# EAGLE design TakpadV6.1 (EAGLE 8.4.0)

## Sheet 1 of 2
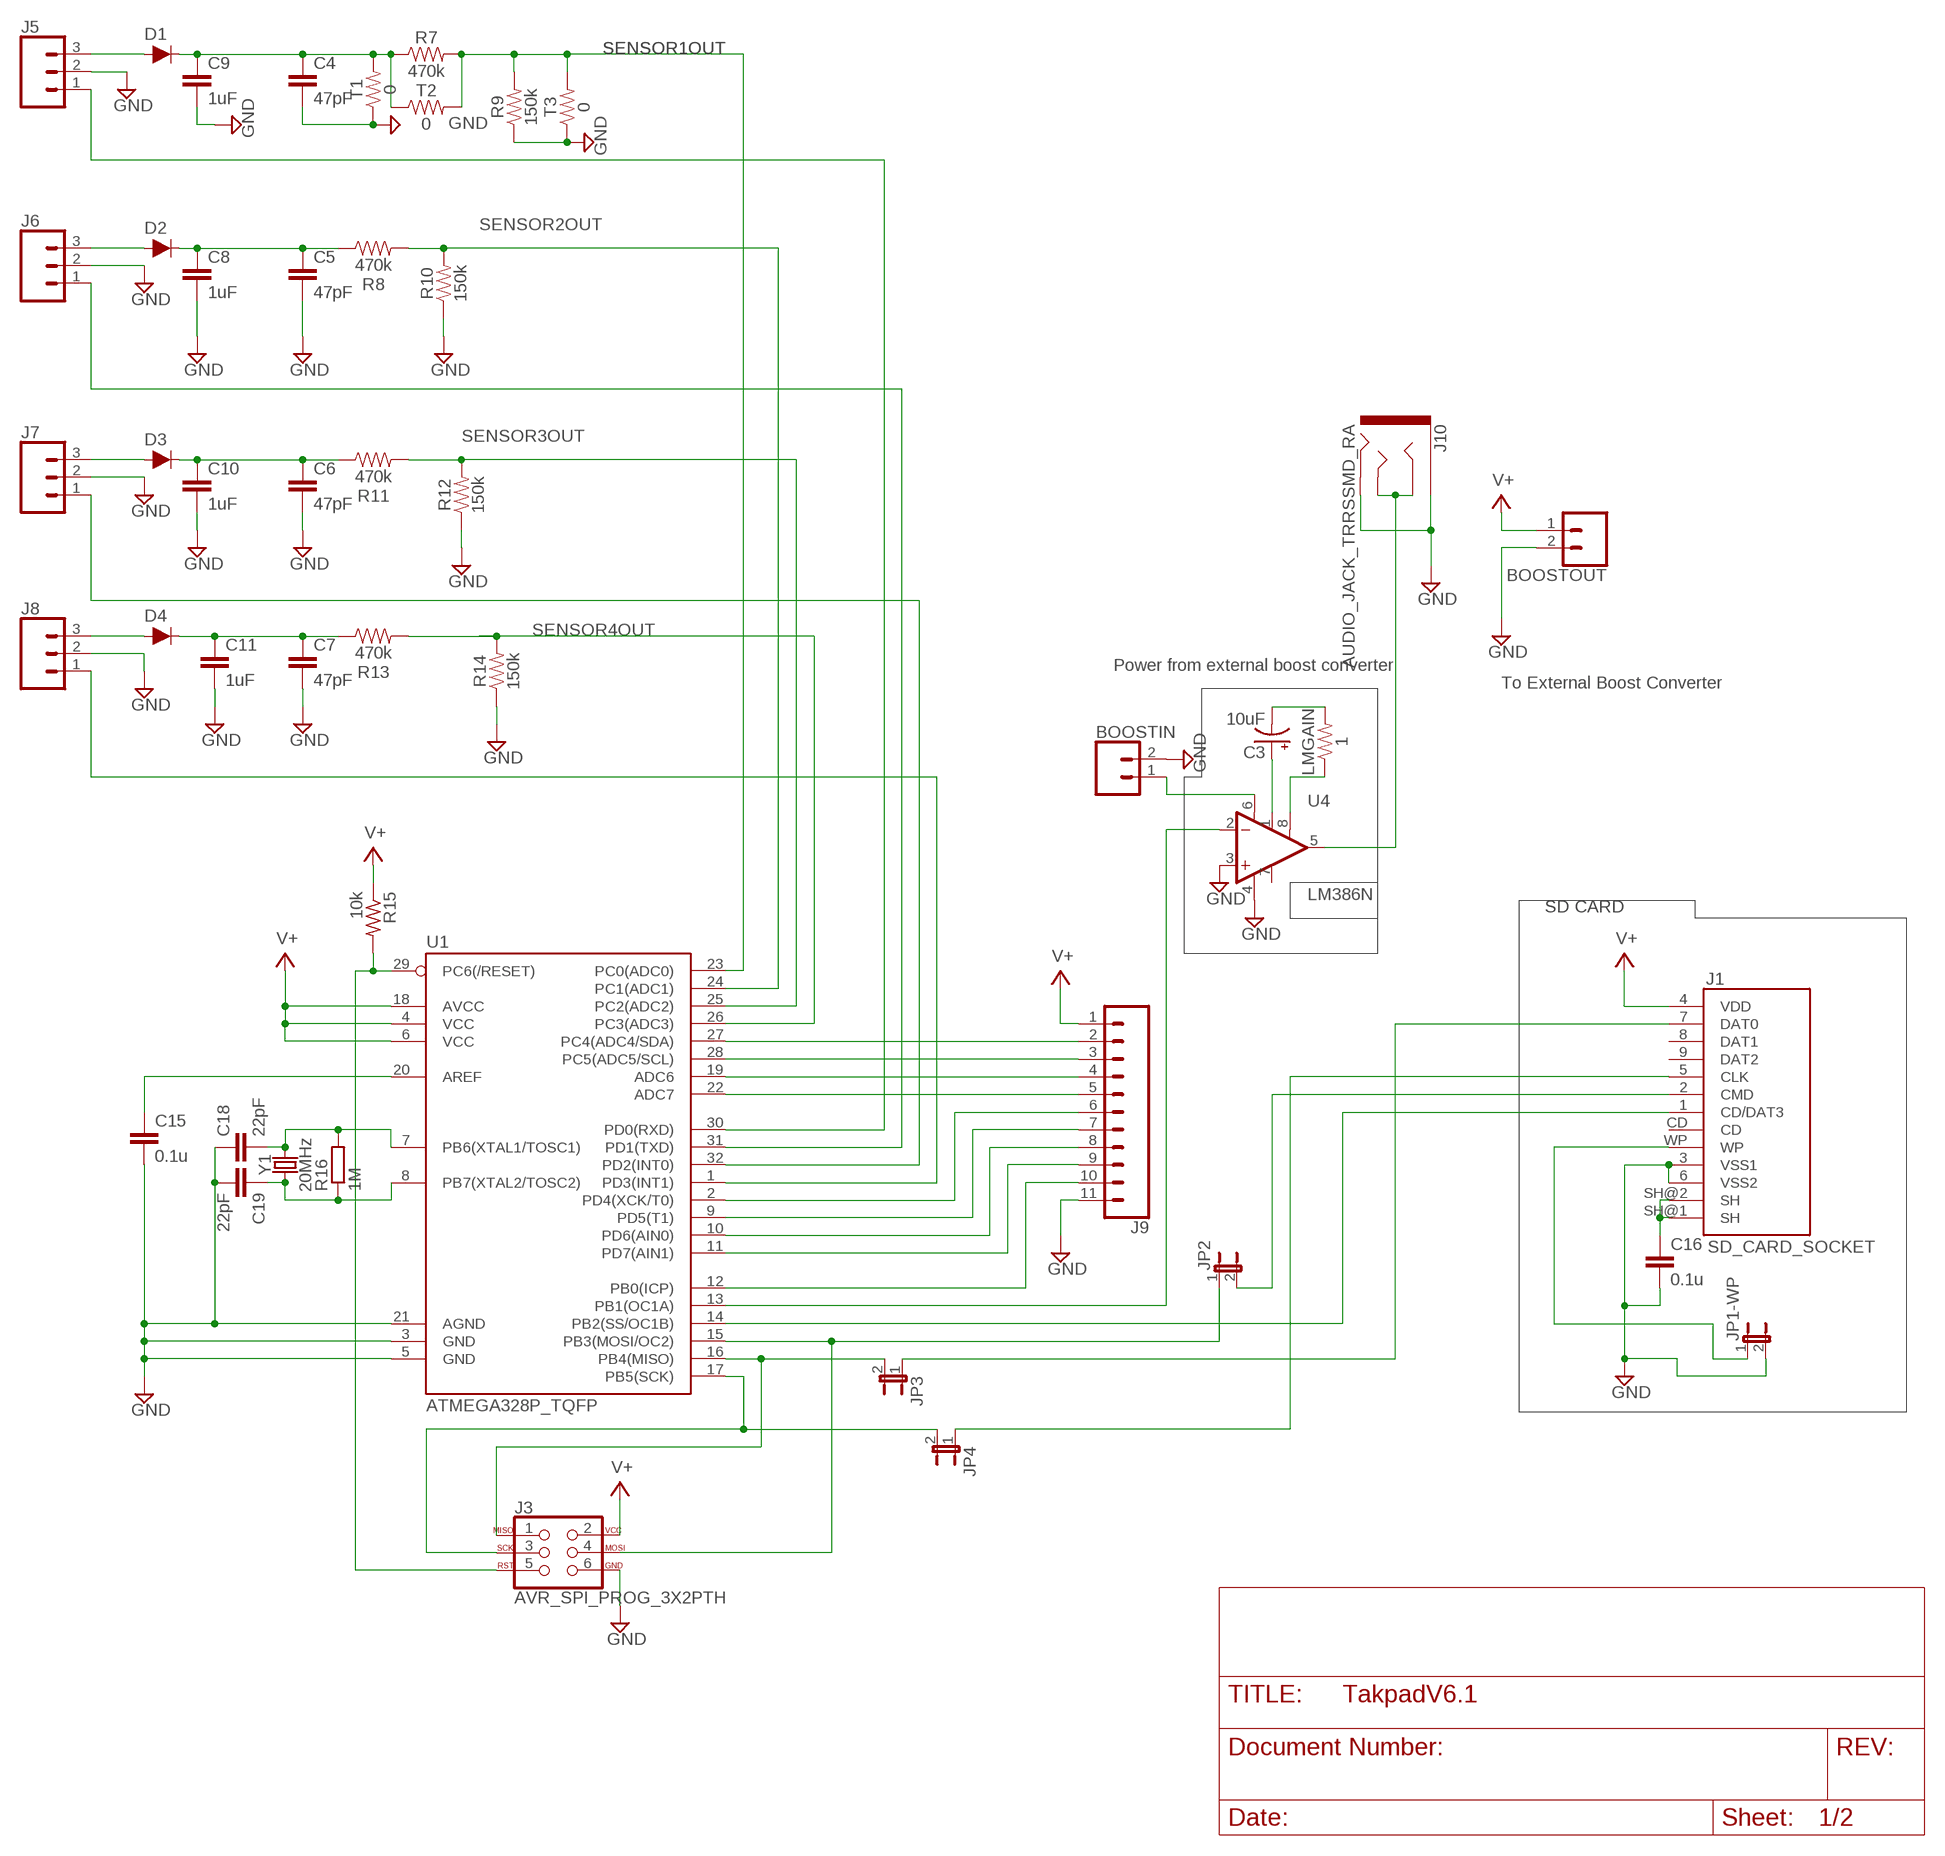
[diagram p0: schematic, sheet 1]

### Parts
BOOSTIN  CONN_02  [1X02]
BOOSTOUT  CONN_02  [1X02]
C3  10uF  10UF-POLAR-RADIAL-2.5MM-KIT-25V-20%  [CPOL-RADIAL-2.5MM-5MM-KIT]
C4  47pF  47PF-0603-50V-5%  [0603]
C5  47pF  47PF-0603-50V-5%  [0603]
C6  47pF  47PF-0603-50V-5%  [0603]
C7  47pF  47PF-0603-50V-5%  [0603]
C8  1uF  47PF-0603-50V-5%  [0603]
C9  1uF  47PF-0603-50V-5%  [0603]
C10  1uF  47PF-0603-50V-5%  [0603]
C11  1uF  47PF-0603-50V-5%  [0603]
C15  0.1u  C-EUC0402  [C0402]
C16  0.1u  C-EUC0402  [C0402]
C18  22pF  C-EUC0402  [C0402]
C19  22pF  C-EUC0402  [C0402]
D1  200mA/100V/1V  DIODE-1N4148  [DIODE-1N4148]
D2  200mA/100V/1V  DIODE-1N4148  [DIODE-1N4148]
D3  200mA/100V/1V  DIODE-1N4148  [DIODE-1N4148]
D4  200mA/100V/1V  DIODE-1N4148  [DIODE-1N4148]
J1  SD_CARD_SOCKET  [SD]
J3  AVR_SPI_PROG_3X2PTH  [2X3]
J5  CONN_03  [1X03]
J6  CONN_03  [1X03]
J7  CONN_03  [1X03]
J8  CONN_03  [1X03]
J9  CONN_11  [1X11]
J10  AUDIO_JACK_TRRSSMD_RA  [AUDIO_JACK_3.5MM_TRRS_SMD_RA]
JP1-WP  JUMPER-2PTH  [1X02]
JP2  JUMPER-2PTH  [1X02]
JP3  JUMPER-2PTH  [1X02]
JP4  JUMPER-2PTH  [1X02]
LMGAIN  1  1OHM-0603-1/10W-1%  [0603]
R7  470k  1KOHM-HORIZ-1/4W-1%  [AXIAL-0.3]
R8  470k  1KOHM-HORIZ-1/4W-1%  [AXIAL-0.3]
R9  150k  1KOHM-HORIZ-1/4W-1%  [AXIAL-0.3]
R10  150k  1KOHM-HORIZ-1/4W-1%  [AXIAL-0.3]
R11  470k  1KOHM-HORIZ-1/4W-1%  [AXIAL-0.3]
R12  150k  1KOHM-HORIZ-1/4W-1%  [AXIAL-0.3]
R13  470k  1KOHM-HORIZ-1/4W-1%  [AXIAL-0.3]
R14  150k  1KOHM-HORIZ-1/4W-1%  [AXIAL-0.3]
R15  10k  R-US_M1206  [M1206]
R16  1M  R-EU_R0402  [R0402]
T1  0  1KOHM-HORIZ-1/4W-1%  [AXIAL-0.3]
T2  0  1KOHM-HORIZ-1/4W-1%  [AXIAL-0.3]
T3  0  1KOHM-HORIZ-1/4W-1%  [AXIAL-0.3]
U1  ATMEGA328P_TQFP  [TQFP32-08]
U4  LM386N  LM386  [DIP08]
Y1  20MHz  CRYSTAL-16MHZPTH-HC49US  [HC49US]

### Nets
ADC4: J9.2 U1.27(PC4(ADC4/SDA))
ADC5: J9.3 U1.28(PC5(ADC5/SCL))
ADC6: J9.4 U1.19(ADC6)
ADC7: J9.5 U1.22(ADC7)
AREF: C15.1 U1.20(AREF)
AUDIOINPUT: U1.13(PB1(OC1A)) U4.2(-IN)
AUDIOOUT: J10.RING1 J10.TIP U4.5(OUT)
CD/DAT3: J1.1(CD/DAT3) U1.14(PB2(SS/OC1B))
CLK: J1.5(CLK) JP4.1
CMD: J1.2(CMD) JP2.2
DAT0: J1.7(DAT0) JP3.1
GND: BOOSTIN.2 BOOSTOUT.2 C4.2 C5.2 C6.2 C7.2 C8.2 C9.2 C10.2 C11.2 C15.2 C16.2 C18.1 C19.2 J1.3(VSS1) J1.6(VSS2) J3.6 J5.2 J6.2 J7.2 J8.2 J9.11 J10.EARTH J10.RING2 JP1-WP.2 R9.P$1 R10.P$1 R12.P$1 R14.P$1 T1.P$1 T3.P$1 U1.3(GND) U1.5(GND) U1.21(AGND) U4.3(+IN) U4.4(V-) ; also sheet 2
MISO: J3.1 JP3.2 U1.16(PB4(MISO))
MOSI: J3.4 JP2.1 U1.15(PB3(MOSI/OC2))
N$9: C3.1(+) U4.1(GAIN)
N$10: C3.2(-) LMGAIN.2
N$11: LMGAIN.1 U4.8(GAIN)
N$17: C16.1 J1.SH@1(SH) J1.SH@2(SH)
PB6: C18.2 R16.2 U1.7(PB6(XTAL1/TOSC1)) Y1.2
PB7: C19.1 R16.1 U1.8(PB7(XTAL2/TOSC2)) Y1.1
PD4: J9.6 U1.2(PD4(XCK/T0))
PD5: J9.7 U1.9(PD5(T1))
PD6: J9.8 U1.10(PD6(AIN0))
PD7: J9.9 U1.11(PD7(AIN1))
PD8: J9.10 U1.12(PB0(ICP))
RST: J3.5 R15.2 U1.29(PC6(/RESET))
SCK: J3.3 JP4.2 U1.17(PB5(SCK))
SENS1LED: J5.1 U1.30(PD0(RXD))
SENS2LED: J6.1 U1.31(PD1(TXD))
SENS3LED: J7.1 U1.32(PD2(INT0))
SENS4LED: J8.1 U1.1(PD3(INT1))
SENSOR1: D1.A J5.3
SENSOR1IN: C4.1 C9.1 D1.C R7.P$1 T1.P$2 T2.P$1
SENSOR1OUT: R7.P$2 R9.P$2 T2.P$2 T3.P$2 U1.23(PC0(ADC0))
SENSOR2: D2.A J6.3
SENSOR2IN: C5.1 C8.1 D2.C R8.P$1
SENSOR2OUT: R8.P$2 R10.P$2 U1.24(PC1(ADC1))
SENSOR3: D3.A J7.3
SENSOR3IN: C6.1 C10.1 D3.C R11.P$1
SENSOR3OUT: R11.P$2 R12.P$2 U1.25(PC2(ADC2))
SENSOR4: D4.A J8.3
SENSOR4IN: C7.1 C11.1 D4.C R13.P$1
SENSOR4OUT: R13.P$2 R14.P$2 U1.26(PC3(ADC3))
UPCONVERTERINPUT: BOOSTIN.1 U4.6(V+)
V+: BOOSTOUT.1 J1.4(VDD) J3.2 J9.1 R15.1 U1.4(VCC) U1.6(VCC) U1.18(AVCC) ; also sheet 2
WP: J1.WP JP1-WP.1
Unconnected: J1.8(DAT1) J1.9(DAT2) J1.CD U4.7(BP)

### Notes on the sheet
- Power from external boost converter
- To External Boost Converter
- SD CARD

## Sheet 2 of 2
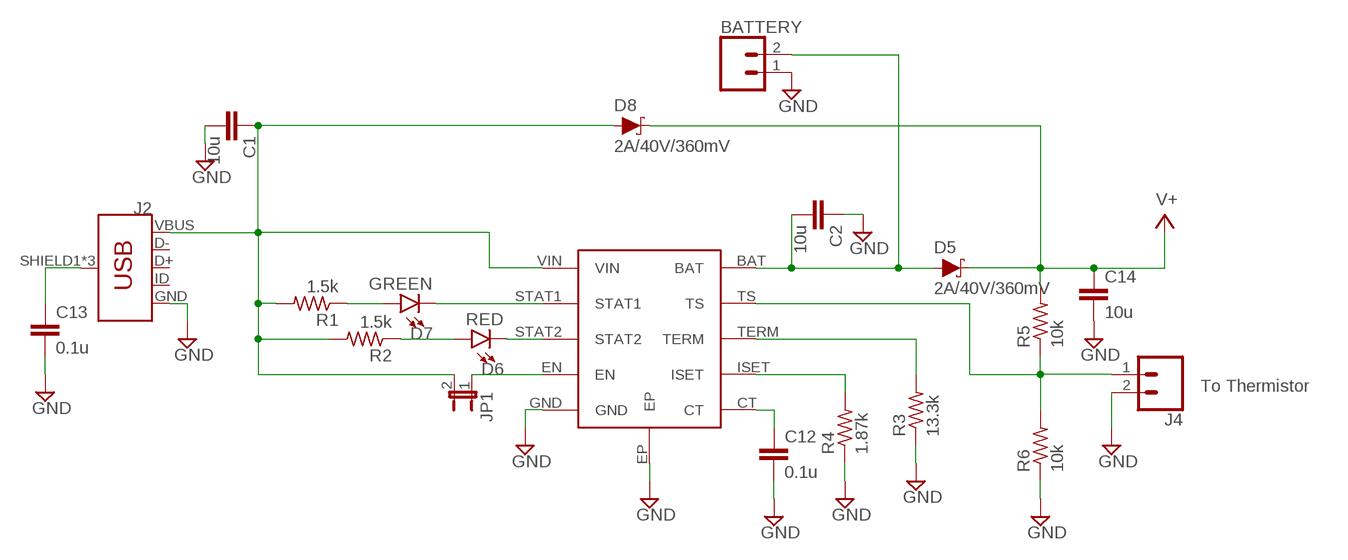
[diagram p1: schematic, sheet 2]

### Parts
BATTERY  CONN_02  [1X02]
C1  10u  C-EUC0402  [C0402]
C2  10u  C-EUC0402  [C0402]
C12  0.1u  C-EUC0402  [C0402]
C13  0.1u  C-EUC0402  [C0402]
C14  10u  C-EUC0402  [C0402]
D5  2A/40V/360mV  DIODE-SCHOTTKY-B340A  [SMA-DIODE]
D6  RED  LED-RED1206  [LED-1206]
D7  GREEN  LED-GREEN1206  [LED-1206]
D8  2A/40V/360mV  DIODE-SCHOTTKY-B340A  [SMA-DIODE]
J2  USB_MICRO-BREDUCED_PASTE  [USB-B-MICRO-SMD_RED_PASTE]
J4  CONN_02  [1X02]
JP1  JUMPER-2PTH  [1X02]
R1  1.5k  R-US_M1206  [M1206]
R2  1.5k  R-US_M1206  [M1206]
R3  13.3k  R-US_M1206  [M1206]
R4  1.87k  R-US_M1206  [M1206]
R5  10k  R-US_M1206  [M1206]
R6  10k  R-US_M1206  [M1206]
U$1  AAT3693  [IDH-AA-T1]

### Nets
BAT: BATTERY.2 C2.2 D5.A U$1.BAT
CT: C12.1 U$1.CT
EN: JP1.1 U$1.EN
GND: BATTERY.1 C1.2 C2.1 C12.2 C13.2 C14.2 J2.GND J4.2 R3.1 R4.1 R6.1 U$1.EP U$1.GND ; also sheet 1
ISET: R4.2 U$1.ISET
N$7: C13.1 J2.SHIELD1(SHIELD) J2.SHIELD2(SHIELD) J2.SHIELD3(SHIELD)
STAT1: D7.C U$1.STAT1
STAT1LED: D7.A R1.1
STAT2: D6.C U$1.STAT2
STAT2LED: D6.A R2.1
TEMPSENSE: J4.1 R5.1 R6.2 U$1.TS
TERM: R3.2 U$1.TERM
V+: C14.1 D5.C D8.C R5.2 ; also sheet 1
VIN: C1.1 D8.A J2.VBUS JP1.2 R1.2 R2.2 U$1.VIN
Unconnected: J2.D+ J2.D- J2.ID

### Notes on the sheet
- To Thermistor

## Library data of the parts
BATTERY BOOSTIN BOOSTOUT J4 = SparkFun-Connectors:CONN_02: Multi connection point. Often used as Generic Header-pin footprint for 0.1 inch spaced/style header connections On any of the 0.1 inch spaced packages, you can populate with these: Break Away Headers - Straight <https://www.sparkfun.com/products/116> (PRT-00116) Break Away Male Headers - Right Angle <https://www.sparkfun.com/products/553> (PRT-00553) Female Headers <https://www.sparkfun.com/products/115> (PRT-00115) Break Away Headers - Machine Pin <https://www.sparkfun.com/products/117> (PRT-00117) Break Away Female Headers - Swiss Machine Pin <https://www.sparkfun.com/products/743> (PRT-00743) For SCREWTERMINALS and SPRING TERMINALS visit here: Screw Terimnals on SparkFun.com <https://www.sparkfun.com/search/results?term=Screw+Terminals> (5mm/3.5mm/2.54mm spacing) This device is also useful as a general connection point to wire up your design to another part of your project. Our various solder wires solder well into these plated through hole pads. Hook-Up Wire - Assortment (Stranded, 22 AWG) <https://www.sparkfun.com/products/11375> (PRT-11375) Hook-Up Wire - Assortment (Solid Core, 22 AWG) <https://www.sparkfun.com/products/11367> (PRT-11367) View the entire wire category on our website here <https://www.sparkfun.com/categories/141> Special notes: Molex polarized connector foot print use with: PRT-08233 with associated crimp pins and housings. 2.54_SCREWTERM for use with PRT-10571. 3.5mm Screw Terminal footprints for PRT-08084 5mm Screw Terminal footprints for use with PRT-08432
C1 C2 C12-C16 = rcl:C-EU: CAPACITOR, European symbol
C3 = SparkFun-Capacitors:10UF-POLAR: 10.0µF polarized capacitors A capacitor is a passive two-terminal electrical component used to store electrical energy temporarily in an electric field.; PROD_ID: CAP-08440
C4-C7 = SparkFun-Capacitors:47PF: 47pF ceramic capacitors A capacitor is a passive two-terminal electrical component used to store electrical energy temporarily in an electric field.; PROD_ID: CAP-08913
C8-C11 = SparkFun-Capacitors:47PF: 47pF ceramic capacitors A capacitor is a passive two-terminal electrical component used to store electrical energy temporarily in an electric field.; PROD_ID: CAP-08913; VALUE: 47pF
C18 C19 = resistor:C-EU: CAPACITOR, European symbol
D1-D4 = SparkFun-DiscreteSemi:DIODE: Diode These are standard reverse protection diodes and small signal diodes. SparkFun Products: SparkFun SparkPunk Sound Kit <https://www.sparkfun.com/products/11177> SparkFun ESP8266 Thing <https://www.sparkfun.com/products/13231>; PROD_ID: DIO-08378
D5 D8 = SparkFun-DiscreteSemi:DIODE-SCHOTTKY: Schottky diode A Schottky diode is a semiconductor diode which has a low forward voltage drop and a very fast switching action.; PROD_ID: DIO-09886; VALUE: 3A/40V/500mV
D6 = SparkFun-LED:LED-RED: Red SMD LED Used in manufacturing of most products at SparkFun Packages: 0603 - SMD 0603 package [Product Link] <http://docs.avagotech.com/docs/AV02-0551EN> 0603 SMART - SMD 0603 SMART package ( more efficient and expensive)[Product Link] <http://www.osram-os.com/Graphics/XPic2/00077099_0.pdf> 1206 - SMD1206 package [Product Link] <https://www.sparkfun.com/datasheets/DevTools/LilyPad/Q150OVS4.pdff> SparkFun Products: Pro Mini 328 -5V <https://www.sparkfun.com/products/821> RedBoard <https://www.sparkfun.com/products/12757> IOIO-OTG <https://www.sparkfun.com/products/13613>; PROD_ID: DIO-09912
D7 = SparkFun-LED:LED-GREEN: Green SMD LED Used in manufacturing of various products at SparkFun Packages: 0603 - SMD 0603 package [Product Link] <http://www.futureelectronics.com/en/technologies/semiconductors/optoelectronics/leds/Pages/9894312-LTST-C190GKT.aspx?CrossPart=HSMG-C190&IM=0> LilyPad 1206 - SMD1206 LilyPad package [Product Link] <http://www.futureelectronics.com/en/Technologies/Product.aspx?ProductID=IN150NGHARVATEKCORPORATION2049943&IM=0> 1206 - SMD1206 package [Product Link] <http://www.futureelectronics.com/en/technologies/semiconductors/optoelectronics/leds/Pages/8315665-LTST-C150KGKT.aspx?IM=0> 1206 Bottom Mount -SMD 1206 Bottom Mount [Product Link] <http://www.digikey.com/product-detail/en/lite-on-inc/LTST-C230KGKT/160-1456-1-ND/386854> SparkFun Products: Pro Mini 328 -5V <https://www.sparkfun.com/products/821> RedBoard <https://www.sparkfun.com/products/12757> MP3 Trigger <https://www.sparkfun.com/products/13720> Makey Makey <https://www.sparkfun.com/products/11076>; PROD_ID: DIO-00862
J1 = SparkFun-Connectors:SD_CARD_SOCKET: SD Memory Card Connector (standard "large" size) Push-push normal type, CD enable, WP enable. Here is the connector we sell at SparkFun: SD/MMC Socket <https://www.sparkfun.com/products/12769> (PRT-12769) Datasheet <https://cdn.sparkfun.com/datasheets/Prototyping/19608.pdf> It is used on these SparkFun products: SparkFun SD/MMC Card Breakout <https://www.sparkfun.com/products/12941> (BOB-12941) SD Sniffer <https://www.sparkfun.com/products/11468> (TOL-11468); PROD_ID: CONN-11976; SF_ID: PRT-12769
J2 = SparkFun-Connectors:USB_MICRO-B: USB Type Micro-B Connector Male/female and PTH/SMT variants SparkFun Products: SparkFun microB USB Breakout <https://www.sparkfun.com/products/12035> SparkFun USB microB Plug Breakout <https://www.sparkfun.com/products/10031> SparkFun ESP8266 Thing <https://www.sparkfun.com/products/13231>; PROD_ID: CONN-11752
J3 = SparkFun-Connectors:AVR_SPI_PROG_3X2: AVR ISP 6 Pin This is the reduced ISP connector for AVR programming. Common on Arduino. This footprint will take up less PCB space and can be used with a 10-pin to 6-pin adapter such as SKU: BOB-08508 **Special note about "TEST_POINT" package. The stop mask is on the top side, so if you want your programming test points to be on the bottom of your board, make sure to place this package on the bottom side of the board. This also ensure that the orientation to program from the bottom side will be correct. SparkFun Products: SparkFun ISP Pogo Adapter <https://www.sparkfun.com/products/11591> - NS Tiny AVR Programmer <https://www.sparkfun.com/products/11801> -PTH
J5-J8 = SparkFun-Connectors:CONN_03: Multi connection point. Often used as Generic Header-pin footprint for 0.1 inch spaced/style header connections On any of the 0.1 inch spaced packages, you can populate with these: Break Away Headers - Straight <https://www.sparkfun.com/products/116> (PRT-00116) Break Away Male Headers - Right Angle <https://www.sparkfun.com/products/553> (PRT-00553) Female Headers <https://www.sparkfun.com/products/115> (PRT-00115) Break Away Headers - Machine Pin <https://www.sparkfun.com/products/117> (PRT-00117) Break Away Female Headers - Swiss Machine Pin <https://www.sparkfun.com/products/743> (PRT-00743) Stackable Header - 3 Pin (Female, 0.1") <https://www.sparkfun.com/products/13875> (PRT-13875) For SCREWTERMINALS and SPRING TERMINALS visit here: Screw Terimnals on SparkFun.com <https://www.sparkfun.com/search/results?term=Screw+Terminals> (5mm/3.5mm/2.54mm spacing) This device is also useful as a general connection point to wire up your design to another part of your project. Our various solder wires solder well into these plated through hole pads. Hook-Up Wire - Assortment (Stranded, 22 AWG) <https://www.sparkfun.com/products/11375> (PRT-11375) Hook-Up Wire - Assortment (Solid Core, 22 AWG) <https://www.sparkfun.com/products/11367> (PRT-11367) View the entire wire category on our website here <https://www.sparkfun.com/categories/141> Special notes: Molex polarized connector foot print use with SKU : PRT-08232 with associated crimp pins and housings.
J9 = SparkFun-Connectors:CONN_11: Multi connection point. Often used as Generic Header-pin footprint for 0.1 inch spaced/style header connections On any of the 0.1 inch spaced packages, you can populate with these: Break Away Headers - Straight <https://www.sparkfun.com/products/116> (PRT-00116) Break Away Male Headers - Right Angle <https://www.sparkfun.com/products/553> (PRT-00553) Female Headers <https://www.sparkfun.com/products/115> (PRT-00115) Break Away Headers - Machine Pin <https://www.sparkfun.com/products/117> (PRT-00117) Break Away Female Headers - Swiss Machine Pin <https://www.sparkfun.com/products/743> (PRT-00743) For SCREWTERMINALS and SPRING TERMINALS visit here: Screw Terimnals on SparkFun.com <https://www.sparkfun.com/search/results?term=Screw+Terminals> (5mm/3.5mm/2.54mm spacing) This device is also useful as a general connection point to wire up your design to another part of your project. Our various solder wires solder well into these plated through hole pads. Hook-Up Wire - Assortment (Stranded, 22 AWG) <https://www.sparkfun.com/products/11375> (PRT-11375) Hook-Up Wire - Assortment (Solid Core, 22 AWG) <https://www.sparkfun.com/products/11367> (PRT-11367) View the entire wire category on our website here <https://www.sparkfun.com/categories/141>
J10 = SparkFun-Connectors:AUDIO_JACK_TRRS: Audio Jack - 3.5mm TRRS (SMD) This is a 3.5mm TRRS SMD audio jack. TRRS connectors are the audio-style connectors that you see on some phones, MP3 players and development boards. TRRS stands for “tip, ring, ring, sleeve,” which reflects that this has three conductors and a ground. SparkFun Products: Audio Jack <https://www.sparkfun.com/products/12639> mbed Starter Kit <https://www.sparkfun.com/products/12968> SparkFun TRRS 3.5mm Jack Breakout <https://www.sparkfun.com/products/11570>; PROD_ID: CONN-10676; SF_ID: PRT-12639
JP1 JP1-WP JP2-JP4 = SparkFun-Retired:JUMPER-2: Jumper Basic 0.1" spaced jumper. Use with breakaway headers.
LMGAIN = SparkFun-Resistors:1OHM: 1Ω resistor A resistor is a passive two-terminal electrical component that implements electrical resistance as a circuit element. Resistors act to reduce current flow, and, at the same time, act to lower voltage levels within circuits. - Wikipedia; PROD_ID: RES-08269
R1-R6 R15 = rcl:R-US_: RESISTOR, American symbol; SPICEPREFIX: R
R7-R14 T1-T3 = SparkFun-Resistors:1KOHM: 1kΩ resistor A resistor is a passive two-terminal electrical component that implements electrical resistance as a circuit element. Resistors act to reduce current flow, and, at the same time, act to lower voltage levels within circuits. - Wikipedia; PROD_ID: RES-12182; VALUE: 1k
R16 = rcl:R-EU_: RESISTOR, European symbol; SPICEPREFIX: R
U1 = SparkFun-IC-Microcontroller:ATMEGA328P_TQFP: Popular 328P in QFP Storefront component: ATmega328 - TQFP <https://www.sparkfun.com/products/13448> (COM-13448) Datasheet <http://www.sparkfun.com/datasheets/Components/SMD/ATMega328.pdf> SparkFun Products SparkFun RedBoard - Programmed with Arduino <https://www.sparkfun.com/products/12757> (DEV-12757) Arduino Pro Mini 328 - 5V/16MHz <https://www.sparkfun.com/products/11113> (DEV-11113) Arduino Pro Mini 328 - 3.3V/8MHz <https://www.sparkfun.com/products/11114> (DEV-11114) SparkFun OpenLog <https://www.sparkfun.com/products/13712> (DEV-13712) SparkFun MicroView - OLED Arduino Module <https://www.sparkfun.com/products/12923> (DEV-12923) SparkFun Digital Sandbox <https://www.sparkfun.com/products/12651> (DEV-12651) SparkFun PicoBoard <https://www.sparkfun.com/products/11888> (WIG-11888) Arduino Fio <https://www.sparkfun.com/products/10116> (DEV-10116) LilyPad Arduino 328 Main Board <https://www.sparkfun.com/products/13342> (DEV-13342) SparkFun RedStick <https://www.sparkfun.com/products/13741> (DEV-13741) LilyPad MP3 <https://www.sparkfun.com/products/11013> (DEV-11013) LilyPad Arduino SimpleSnap <https://www.sparkfun.com/products/10941> (DEV-10941) SparkFun Stepoko <https://www.sparkfun.com/products/13899> (ROB-13899) SparkFun Geiger Counter <https://www.sparkfun.com/products/11345> (SEN-11345) SparkFun EL Sequencer <https://www.sparkfun.com/products/12781> (COM-12781) Arduino Pro 328 - 5V/16MHz <https://www.sparkfun.com/products/10915> (DEV-10915) CryptoCape <https://www.sparkfun.com/products/12773> (DEV-12773) SparkFun IR Thermometer Evaluation Board - MLX90614 <https://www.sparkfun.com/products/10740> (SEN-10740) SparkFun RedBot Mainboard <https://www.sparkfun.com/products/12097> (ROB-12097) Arduino Pro 328 - 3.3V/8MHz <https://www.sparkfun.com/products/10914> (DEV-10914) SparkFun Block for Intel® Edison - Arduino <https://www.sparkfun.com/products/13036> (DEV-13036) SparkFun Simon Says - Surface Mount Soldering Kit <https://www.sparkfun.com/products/10935> (KIT-10935) SparkFun 7-Segment Serial Display - Red <https://www.sparkfun.com/products/11441> (COM-11441) SparkFun 7-Segment Serial Display - White <https://www.sparkfun.com/products/11629> (COM-11629) SparkFun 7-Segment Serial Display - Yellow <https://www.sparkfun.com/products/11443> (COM-11443) SparkFun 7-Segment Serial Display - Kelly Green <https://www.sparkfun.com/products/11440> (COM-11440) SparkFun 7-Segment Serial Display - Blue <https://www.sparkfun.com/products/11442> (COM-11442) SparkFun OpenSegment Serial Display - 20mm (Blue) <https://www.sparkfun.com/products/11647> (COM-11647) SparkFun OpenSegment Serial Display - 20mm (Green) <https://www.sparkfun.com/products/11646> (COM-11646) SparkFun OpenSegment Serial Display - 20mm (White) <https://www.sparkfun.com/products/11648> (COM-11648) SparkFun OpenSegment Serial Display - 20mm (Red) <https://www.sparkfun.com/products/11644> (COM-11644) SparkFun OpenSegment Serial Display - 20mm (Yellow) <https://www.sparkfun.com/products/11645> (COM-11645) SparkFun OpenSegment Shield <https://www.sparkfun.com/products/13190> (DEV-13190); PROD_ID: IC-09069
U4 = SparkFun-IC-Amplifiers:LM386: low voltage audio power amplifier SparkFun Products FabFM Radio Kit <https://www.sparkfun.com/products/11043> (KIT-11043); PROD_ID: IC-10899
U$1 = AAT3693:AAT3693
Y1 = SparkFun-Clocks:CRYSTAL-16MHZ: 16MHz Crystal Digikey Example <http://www.digikey.com/product-search/en?keywords=535-9122-1-ND> Frequency: 16MHz Frequency Stability: ±50ppm Frequency Tolerance: ±20ppm Load Capacitance: 18pF SparkFun Products: Pro Micro -5V/16MHz <https://www.sparkfun.com/products/12640> SparkFun Serial Enabled LCD Kit <https://www.sparkfun.com/products/10097>; PROD_ID: XTAL-08181; SF_ID: COM-00536; VALUE: 16MHz

## Board
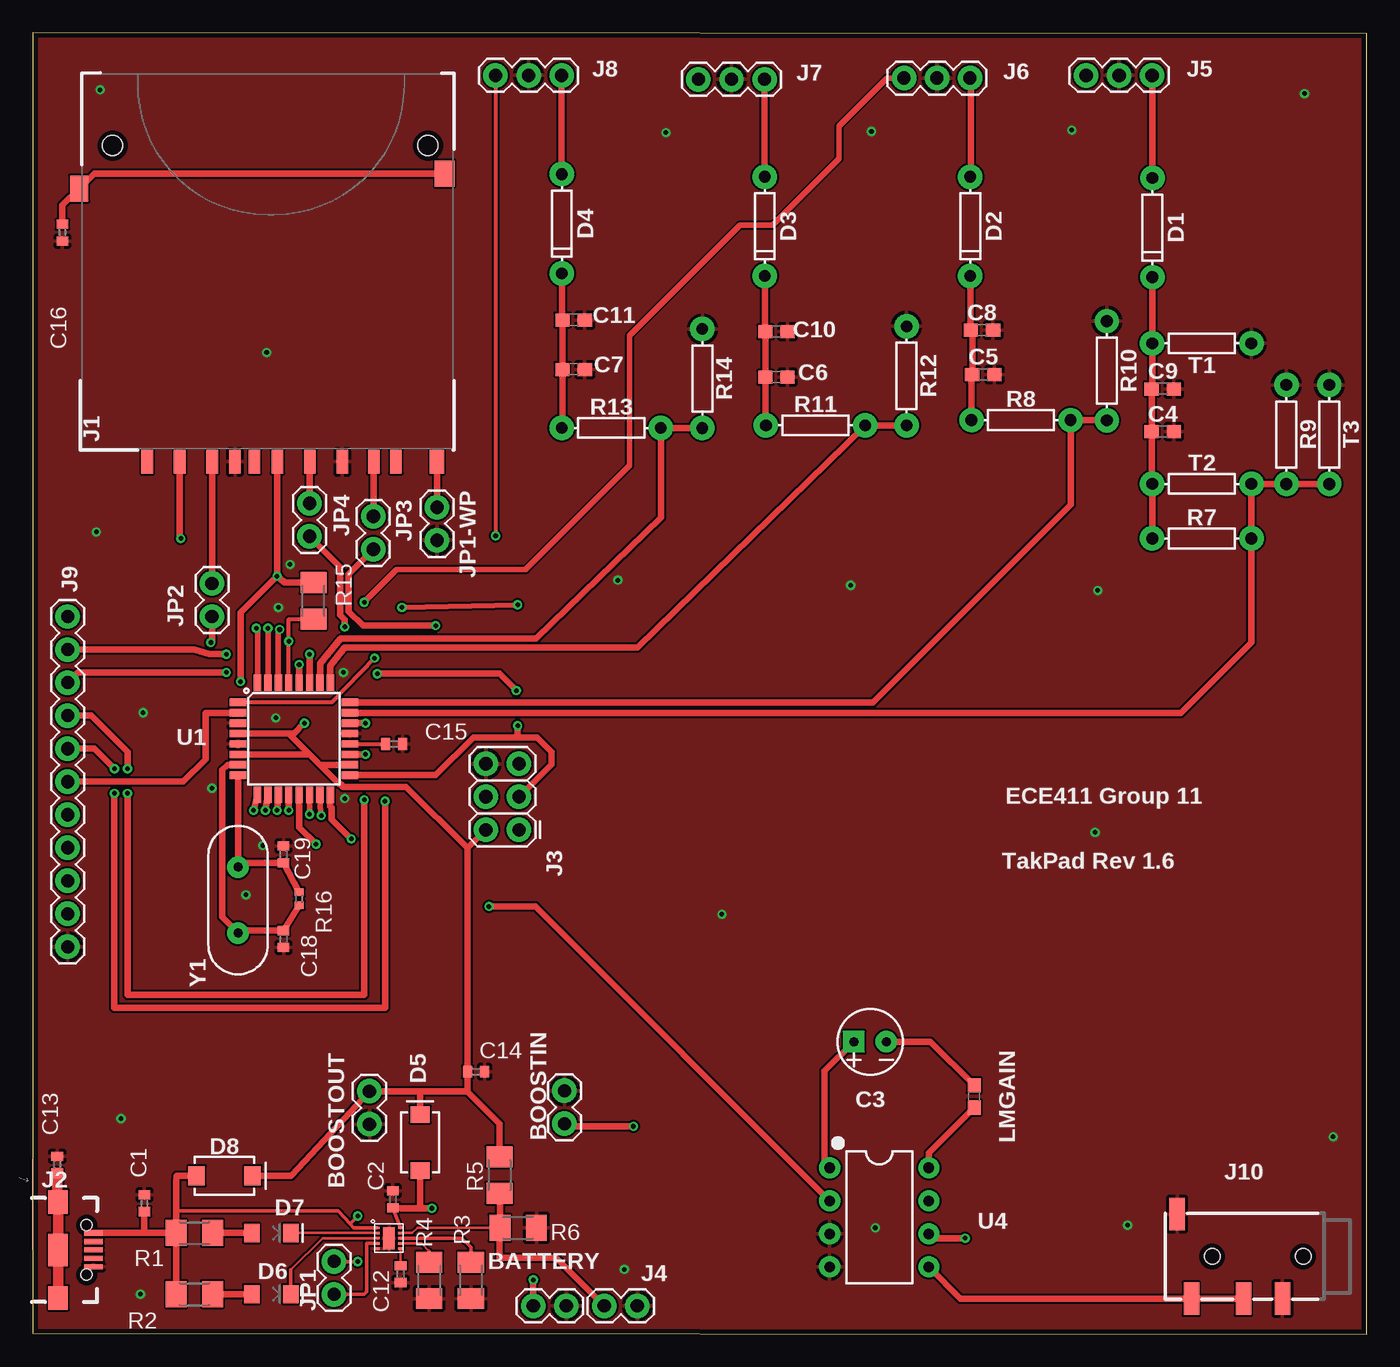
[diagram p2: board, top side]
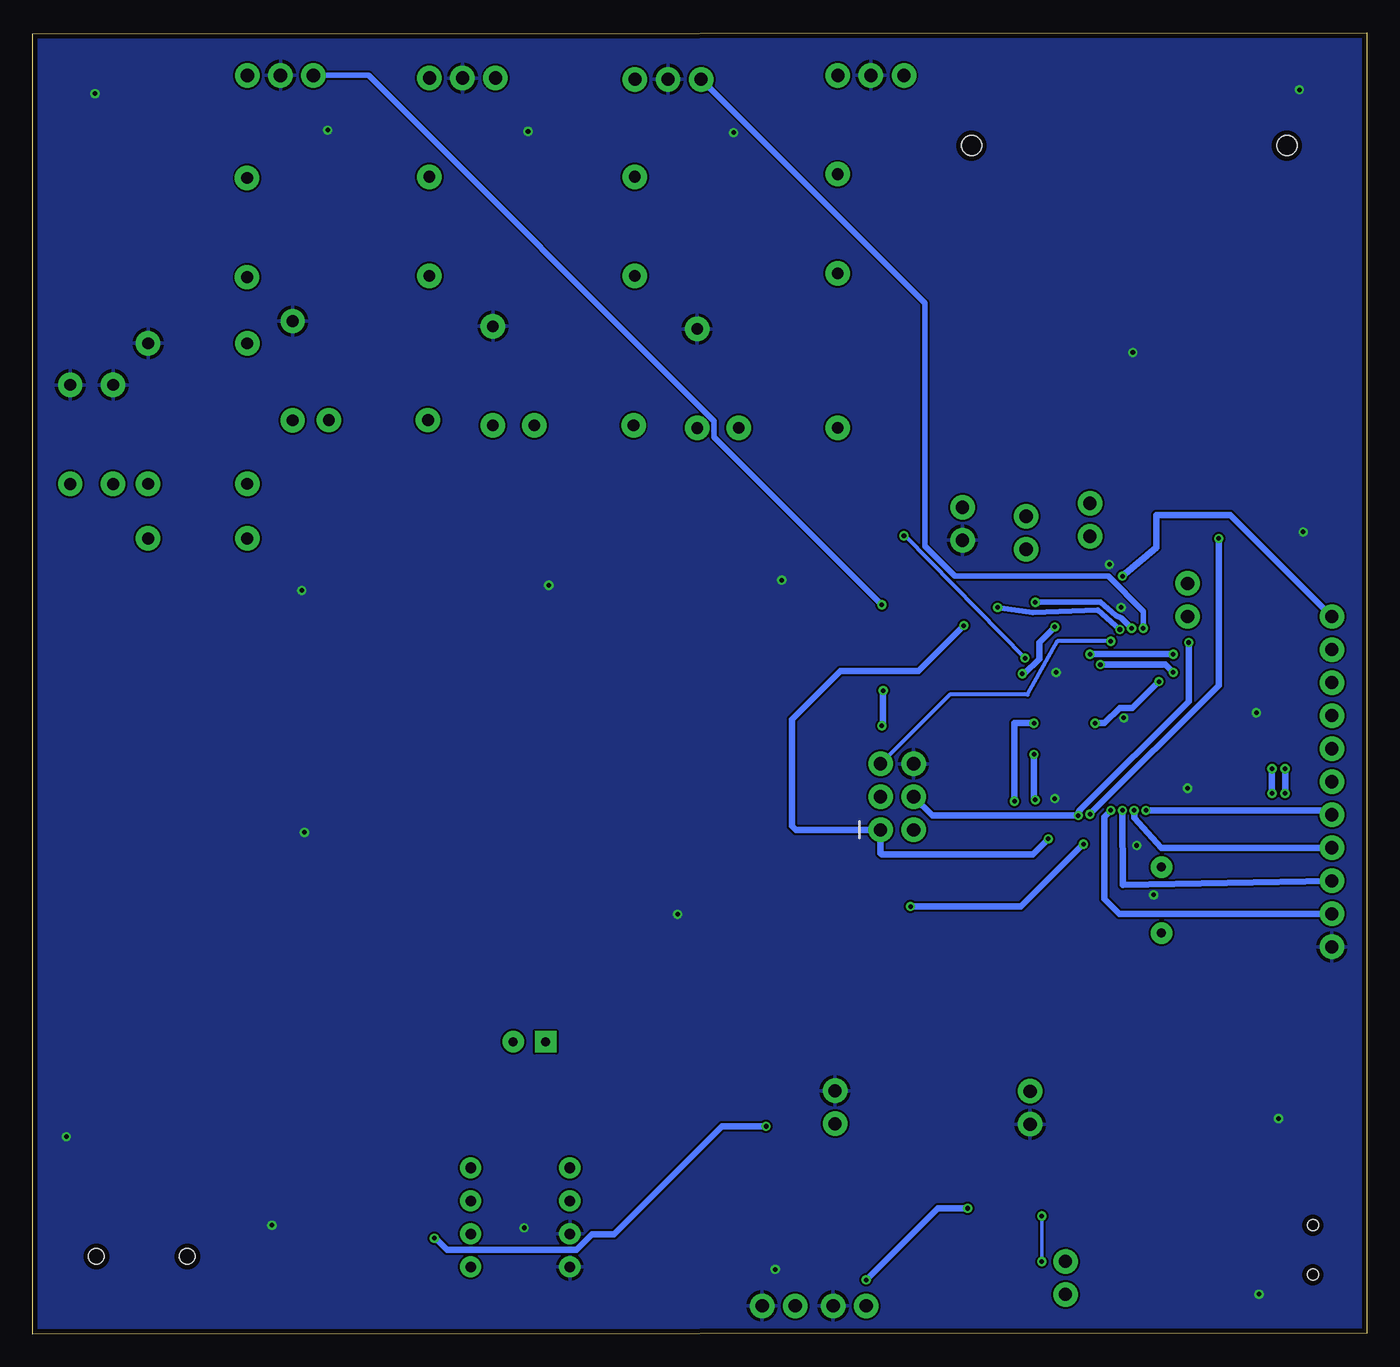
[diagram p3: board, bottom side, seen from below]

Size 102.6 x 100.1 mm. Coordinates in mm from the lower left corner, seen from the top.
Outline: 0,0.1 102.6,0 102.6,100 0,100.1 0,0.1
Copper layers (1*16): Top 0.0356mm / dielectric 1.5011mm / Bottom 0.0356mm
Design rules "LaenPCBOrder": minimum track width 6mil, minimum drill 13mil, track to track 6mil, track to pad 6mil, pad to pad 6mil, via to via 6mil, smd to smd 6mil, copper to edge 15mil, drill to drill 6mil, minimum pad ring 7mil, minimum via ring 7mil, stop-mask expansion 3mil, vias tented up to drill 0mil, thermal gap 10mil

### Footprints (pad centres in the part's own frame; a part is rotated, then mirrored left to right if it is on the bottom)
1X02 = drill 1.016 pad 1.88: 1 0,0; 2 2.54,0
C0402 = smd 0.7 x 0.9: 1 -0.65,0; 2 0.65,0
CPOL-RADIAL-2.5MM-5MM-KIT = drill 0.7 pad 1.651 square: 1 1.25,0 | drill 0.7 pad 1.651: 2 -1.25,0
0603 = smd 1.1 x 1: 1 -0.85,0; 2 0.85,0
DIODE-1N4148 = drill 0.9 pad 1.88: A -3.81,0; C 3.81,0
SMA-DIODE = smd 1.27 x 1.47: A -2.15,0; C 2.15,0
LED-1206 = smd 1.2 x 1.4: A -1.5,0; C 1.5,0
SD = smd 1.8 x 0.9: 1 -1,6.77; 2 -1,4.27; 3 -1,2.52; 4 -1,-0.73; 5 -1,-3.23; 6 -1,-5.73; 7 -1,-8.15; 8 -1,-9.85; 9 -1,9.27; CD -1,1.02 | smd 2 x 1.4: SH@1 20,14.496 | smd 2 x 1.527: SH@2 21.15,-13.589 | smd 1.8 x 1.1: WP -1,-13 | hole 1.55: 23.3,11.94; 23.3,-12.32
USB-B-MICRO-SMD_RED_PASTE = smd 1.45 x 0.4: D+ 2.725,0; D- 2.725,0.65; GND 2.725,-1.3; ID 2.725,-0.65; VBUS 2.725,1.3 | smd 1.5 x 1.8: SHIELD1 0,3.685; SHIELD2 0,-3.685 | smd 1.5 x 2.5: SHIELD3 0,0 | hole 0.85: 2.2,1.9; 2.2,-1.9
2X3 = drill 1.016 pad 1.88: 1 0,0; 2 0,2.54; 3 2.54,0; 4 2.54,2.54; 5 5.08,0; 6 5.08,2.54
1X03 = drill 1.016 pad 1.88: 1 0,0; 2 2.54,0; 3 5.08,0
1X11 = drill 1.016 pad 1.88: 1 0,0; 2 2.54,0; 3 5.08,0; 4 7.62,0; 5 10.16,0; 6 12.7,0; 7 15.24,0; 8 17.78,0; 9 20.32,0; 10 22.86,0; 11 25.4,0
AUDIO_JACK_3.5MM_TRRS_SMD_RA = smd 1.2 x 2.5: EARTH 11.3,-3.25; RING1 6.2,3.25; RING2 3.2,3.25; TIP 10.2,3.25 | hole 1.2: 1.6,0; 8.6,0
M1206 = smd 1.6 x 2: 1 -1.4,0; 2 1.4,0
AXIAL-0.3 = drill 0.9 pad 1.88: P$1 -3.81,0; P$2 3.81,0
R0402 = smd 0.6 x 0.7: 1 -0.5,0; 2 0.5,0
TQFP32-08 = smd 1.27 x 0.559: 1 -4.293,2.8; 2 -4.293,2; 3 -4.293,1.2; 4 -4.293,0.4; 5 -4.293,-0.4; 6 -4.293,-1.2; 7 -4.293,-2; 8 -4.293,-2.8; 17 4.293,-2.8; 18 4.293,-2; 19 4.293,-1.2; 20 4.293,-0.4; 21 4.293,0.4; 22 4.293,1.2; 23 4.293,2; 24 4.293,2.8 | smd 0.559 x 1.27: 9 -2.8,-4.293; 10 -2,-4.293; 11 -1.2,-4.293; 12 -0.4,-4.293; 13 0.4,-4.293; 14 1.2,-4.293; 15 2,-4.293; 16 2.8,-4.293; 25 2.8,4.293; 26 2,4.293; 27 1.2,4.293; 28 0.4,4.293; 29 -0.4,4.293; 30 -1.2,4.293; 31 -2,4.293; 32 -2.8,4.293
DIP08 = drill 0.813 pad 1.626: 1 -3.81,-3.81; 2 -1.27,-3.81; 3 1.27,-3.81; 4 3.81,-3.81; 5 3.81,3.81; 6 1.27,3.81; 7 -1.27,3.81; 8 -3.81,3.81
IDH-AA-T1 = smd 0.4 x 0.18: BAT 0.9,0.8; CT 0.9,-0.8; EN -0.9,-0.4; GND -0.9,-0.8; ISET 0.9,-0.4; STAT1 -0.9,0.4; STAT2 -0.9,0; TERM 0.9,0; TS 0.9,0.4; VIN -0.9,0.8 | smd 0.9 x 1.7: EP 0,0
HC49US = drill 0.7 pad 1.651: 1 -2.54,0; 2 2.54,0

### Placement (x,y rotation side)
BATTERY  41.04,2.2 180 top
BOOSTIN  40.9,16.2 90 top
BOOSTOUT  25.9,18.7 270 top
C1  8.6,10.1 90 top
C2  27.7,10.4 270 top
C3  64.4,22.5 180 top
C4  86.9,69.4 0 top
C5  73.1,73.8 0 top
C6  57.2,73.6 0 top
C7  41.6,74.2 0 top
C8  73,77.2 0 top
C9  86.9,72.7 0 top
C10  57.2,77.1 0 top
C11  41.6,78 0 top
C12  28.3,4.64 270 top
C13  1.9,13.06 90 top
C14  34.1,20.2 0 top
C15  27.8,45.4 0 top
C16  2.3,84.7 270 top
C18  19.3,30.4 90 top
C19  19.3,36.9 90 top
D1  86.1,85.1 270 top
D2  72.1,85.2 270 top
D3  56.3,85.2 270 top
D4  40.7,85.4 270 top
D5  29.8,14.76 90 top
D6  18.36,3.1 0 top
D7  18.36,7.8 0 top
D8  14.76,12.2 0 top
J1  18.09,68.1 90 top
J2  1.96,6.5 0 top
J3  37.4,38.8 90 top
J4  43.96,2.2 0 top
J5  81,96.8 0 top
J6  67,96.6 0 top
J7  51.2,96.5 0 top
J8  35.6,96.8 0 top
J9  2.7,55.2 270 top
J10  99.3,6 180 top
JP1  23.18,3.08 90 top
JP1-WP  31.1,63.6 270 top
JP2  13.8,55.2 90 top
JP3  26.2,62.9 270 top
JP4  21.3,63.9 270 top
LMGAIN  72.4,18.3 90 top
R1  12.44,7.8 180 top
R2  12.44,3.1 180 top
R3  33.7,4.16 90 top
R4  30.5,4.16 90 top
R5  35.9,12.26 90 top
R6  37.34,8.2 180 top
R7  89.9,61.2 0 top
R8  76,70.3 0 top
R9  96.4,69.2 270 top
R10  82.6,74.1 270 top
R11  60.2,69.9 0 top
R12  67.2,73.7 270 top
R13  44.5,69.7 0 top
R14  51.5,73.5 270 top
R15  21.6,56.4 270 top
R16  20.5,33.5 270 top
T1  89.9,76.2 180 top
T2  89.9,65.4 0 top
T3  99.7,69.2 270 top
U1  20.1,45.8 0 top
U4  65.1,9 270 top
U$1  27.4,7.4 0 top
Y1  15.8,33.4 270 top

### Tracks (layer width: path | path; a pad name or v marks a point on that pad's centre or on a via)
ADC4  (via drill 0.35)
  Top 0.508: J9.2 12.44,52.66 13.6,52.3 v14.9,52.3 | U1.27 v21.3,52.3
  Bottom 0.508: v21.3,52.3 v14.9,52.3
ADC5  (via drill 0.35)
  Top 0.508: v14.9,50.9 3.48,50.9 J9.3 | U1.28 v20.5,51.5
  Bottom 0.508: v14.9,50.9 15.5,51.5 v20.5,51.5
ADC6  (via drill 0.35)
  Top 0.508: U1.19 v25.6,44.6 | v25.5,41.1 25.5,26.1 7.3,26.1 v7.3,41.6 | v7.3,43.5 7.3,44.8 4.52,47.58 J9.4
  Bottom 0.508: v25.6,44.6 25.6,41.2 v25.5,41.1 | v7.3,43.5 v7.3,41.6
ADC7  (via drill 0.35)
  Top 0.508: U1.22 v25.6,47 | v27.1,41 27.1,25.1 6.3,25.1 v6.3,41.6 | v6.3,43.5 4.76,45.04 J9.5
  Bottom 0.508: v25.6,47 27.1,47 v27.1,41 | v6.3,43.5 v6.3,41.6
AREF
  Top 0.305: U1.20 C15.1
AUDIOINPUT  (via drill 0.35)
  Top 0.508: U4.2 38.66,32.9 v35.1,32.9 | v21.8,37.7 20.5,39 U1.13
  Bottom 0.508: v21.8,37.7 26.6,32.9 v35.1,32.9
AUDIOOUT
  Top 0.508: J10.RING1 J10.TIP 71.35,2.75 U4.5
BAT  (via drill 0.35)
  Top 0.254: U$1.BAT C2.2
  Top 0.508: 29.8,9.7 D5.A | 29.8,9.7 28.35,9.7 C2.2 | v30.7,9.7 29.8,9.7 | v38.5,4.2 BATTERY.2
  Bottom 0.508: v30.7,9.7 33,9.7 v38.5,4.2
CD/DAT3  (via drill 0.35)
  Top 0.406: v21.3,40 U1.14
  Top 0.508: J1.1 11.32,61.28 v11.4,61.2
  Bottom 0.508: v11.4,61.2 11.4,49.9 v21.3,40
CLK
  Top 0.508: JP4.1 21.32,63.92 J1.5
CMD
  Top 0.508: J1.2 13.82,57.76 JP2.2
CT
  Top 0.203: U$1.CT C12.1
DAT0
  Top 0.508: JP3.1 26.24,62.94 J1.7
EN
  Top 0.254: JP1.1 25.48,3.08 25.7,3.3 25.7,7 U$1.EN
GND  (via drill 0.35)
  other vias: 18.7,47.4 13.8,42 19.8,59.2 53,32.3 45.5,5 18.9,55.9 81.9,57.2 62.9,57.6 45,58 18,75.5 100,15.2 64.8,8.2 84.2,8.4 8.3,3.1 6.8,16.6 48.7,92.4 64.5,92.5 79.9,92.6 16.4,33.8 17.7,37.6 8.5,47.8 4.9,61.7 97.8,95.4 5.2,95.7 23.9,50.9 24,41.2 81.7,38.6
  pour Top: 8.6,100 0.1,100.1 0.2,0.2 2.6,0.3 102.5,0.1 102.5,4.7 102.3,100 87.1,99.9
  pour Bottom: 0.1,100.1 0.1,0.2 8.7,0.3 102.4,0.1 102.5,0.8 102.3,99.9 5.7,100.1
ISET
  Top 0.203: U$1.ISET 29.9,7 30.5,6.4
  Top 0.254: 30.5,6.4 R4.2
MISO  (via drill 0.35)
  Top 0.508: U1.16 22.9,40.6 23,40.5 23,39.6 v24.5,38.1 | v31,54.5 25.4,54.5 24.3,55.6 24.3,58.46 JP3.2
  Bottom 0.508: v24.5,38.1 25.7,36.9 37.3,36.9 37.4,37 J3.1 43.9,38.8 44.2,39.1 44.2,47.3 40.5,51 34.5,51 v31,54.5
MOSI  (via drill 0.35)
  Top 0.406: v22.2,39.9 22.1,40.61 U1.15
  Top 0.508: JP2.1 13.8,53.3 v13.7,53.2
  Bottom 0.508: v13.7,53.2 13.7,48.67 22.06,40.31 22.16,40.14 v22.2,39.9 33.42,39.9 J3.4
N$7
  Top 0.813: C13.1 1.9,11.03 J2.SHIELD1 J2.SHIELD3 J2.SHIELD2
N$9
  Top 0.508: C3.1 60.9,20.25 60.9,13.2 U4.1
N$10
  Top 0.508: C3.2 69.05,22.5 LMGAIN.2
N$11
  Top 0.508: U4.8 68.91,13.96 LMGAIN.1
N$17
  Top 0.508: C16.1 2.3,86.81 J1.SH@1 4.74,89.25 J1.SH@2
PB6
  Top 0.508: R16.2 C18.2 15.99,31.05 Y1.2 14.57,32.09 14.57,36.45 14.6,36.48 14.6,43.4 15,43.8 U1.7
PB7
  Top 0.508: R16.1 C19.1 16.11,36.25 Y1.1 U1.8
PD4
  Top 0.508: J9.6 11.6,42.5 13.3,44.2 13.3,47.8 U1.2
PD5  (via drill 0.35)
  Top 0.508: U1.9 v17,40.3
  Bottom 0.508: v17,40.3 3.04,40.3 J9.7
PD6  (via drill 0.35)
  Top 0.508: U1.10 v17.9,40.3
  Bottom 0.508: v17.9,40.3 17.9,39.7 15.82,37.42 J9.8
PD7  (via drill 0.35)
  Top 0.508: U1.11 v18.8,40.3
  Bottom 0.508: v18.8,40.3 18.78,34.58 J9.9
PD8  (via drill 0.35)
  Top 0.508: U1.12 v19.7,40.3
  Bottom 0.508: v19.7,40.3 20.2,39.8 20.2,33.5 19.04,32.34 J9.10
RST  (via drill 0.35)
  Top 0.305: U1.29 v19.7,53.3 19.7,55 R15.2
  Bottom 0.305: v19.7,53.3 23.8,53.3 26.1,49.2 32.08,49.2 J3.5
SCK  (via drill 0.35)
  Top 0.508: U1.17 31,43 33.9,45.9 37.2,45.9 | 37.2,45.9 38.8,45.9 39.9,44.8 39.9,43.84 J3.3 | v24,54.4 24,54.97 23.64,55.33 23.64,59.02 JP4.2 | v37.3,46.8 37.3,46 37.2,45.9 | v26.5,50.8 35.9,50.8 v37.2,49.5
  Bottom 0.508: v24,54.4 25.2,53.2 25.2,51.95 25.22,51.91 26.33,50.8 v26.5,50.8 | v37.2,49.5 37.2,46.9 v37.3,46.8
SENS1LED  (via drill 0.35)
  Top 0.406: v19,54.2 18.9,54.1 U1.30 | v28.4,55.9 v37.3,56.1
  Bottom 0.406: v19,54.2 20.7,55.7 25.7,55.5 v28.4,55.9 | v37.3,56.1 50.2,69 50.2,70.23 76.78,96.8 J5.1
SENS2LED  (via drill 0.35)
  Top 0.406: U1.31 v18.1,54.3 | v25.5,56.3 28,58.8 37.9,58.8 45.9,66.8 45.9,76.8 54.4,85.3 56.9,85.3 62,90.4 62,92.9 65.7,96.6 J6.1
  Bottom 0.406: v18.1,54.3 18.29,54.49 18.89,55.09 19.29,55.29 20.5,56.3 v25.5,56.3
SENS3LED  (via drill 0.35)
  Top 0.406: v17.2,54.3 17.3,54.2 U1.32
  Bottom 0.406: v17.2,54.3 17.2,55.6 19.9,58.3 31.7,58.3 34,60.6 34,79.3 J7.1
SENS4LED  (via drill 0.35)
  Top 0.305: J8.1 v35.6,61.4 | U1.1 23,48.6 v26.3,52
  Bottom 0.305: v35.6,61.4 35.5,61.4 v26.3,52
SENSOR1
  Top 0.508: D1.A 86.1,94.96 86.08,94.98 J5.3
SENSOR1IN
  Top 0.508: D1.C T1.P$2 86.09,72.74 C9.1 C4.1 86.05,65.44 T2.P$1 R7.P$1
SENSOR1OUT
  Top 0.508: T3.P$2 R9.P$2 T2.P$2 R7.P$2 93.71,53.21 88.3,47.8 U1.23
SENSOR2
  Top 0.508: 72.14,89.05 72.16,89.07 | 72.14,89.05 D2.A | J6.3 72.14,96.53 72.14,89.05
SENSOR2IN
  Top 0.508: D2.C 72.1,77.25 C8.1 72.25,77.1 C5.1 72.19,73.74 R8.P$1
SENSOR2OUT
  Top 0.508: R8.P$2 | R8.P$2 R10.P$2 | U1.24 64.6,48.6 79.82,63.82 R8.P$2
SENSOR3
  Top 0.508: 56.26,89.05 D3.A 56.28,89.03 J7.3
SENSOR3IN
  Top 0.508: D3.C 56.3,77.15 C10.1 C6.1 56.35,69.94 R11.P$1
SENSOR3OUT
  Top 0.508: R11.P$2 | R11.P$2 R12.P$2 | U1.25 22.9,51.4 24,52.8 46.53,52.8 R11.P$2
SENSOR4
  Top 0.508: D4.A 40.66,89.25 40.68,89.27 J8.3
SENSOR4IN
  Top 0.508: D4.C 40.7,78.05 C11.1 C7.1 40.75,69.76 R13.P$1
SENSOR4OUT
  Top 0.508: U1.26 22.1,51.6 23.7,53.5 38.7,53.5 48.31,62.81 R13.P$2 R14.P$2
STAT1
  Top 0.203: D7.C U$1.STAT1
STAT1LED
  Top 0.508: R1.1 D7.A
STAT2
  Top 0.203: U$1.STAT2 22.3,7.4 19.86,4.96
  Top 0.254: 19.86,4.96 D6.C
STAT2LED
  Top 0.508: R2.1 D6.A
TEMPSENSE
  Top 0.203: R6.2 29.6,8.2 29.2,7.8 28.4,7.8 | U$1.TS 28.32,7.8 28.4,7.8 | U$1.TS 28.4,7.8
  Top 0.508: 35.8,10.76 R5.1 35.94,10.82 R6.2 35.9,8.16 35.9,5.9 40.26,5.9 J4.1
TERM
  Top 0.254: U$1.TERM 33,7.4 33.7,6.7 R3.2
UPCONVERTERINPUT  (via drill 0.35)
  Top 0.508: v46.2,16 41.1,16 BOOSTIN.1 | v71.7,7.4 69.24,7.4 U4.6
  Bottom 0.508: v46.2,16 49.6,16 57.9,7.7 59.6,7.7 60.78,6.51 70.73,6.51 71.62,7.4 v71.7,7.4
V+  (via drill 0.35)
  Top 0.508: D8.C 19.9,12.2 BOOSTOUT.1 29.8,18.7 | 29.8,18.7 D5.C | 33.4,18.7 29.8,18.7 | 33.4,18.7 35.9,16.2 R5.2 | 33.4,18.7 33.45,18.75 C14.1 33.45,37.39 | 33.45,37.39 J3.2 | 33.45,37.39 28.74,42.1 23.9,42.1 23.69,42.31 23.59,42.31 22.05,43.85 | U1.6 21.3,44.6 | 22.05,43.85 21.3,44.6 | 19.7,46.2 21.3,44.6 | 19.7,46.2 U1.4 | J1.4 18.82,60.58 v18.8,58.3 | v20.9,47 20.1,46.2 19.7,46.2 | R15.1 19.4,57.8 v18.8,58.3 | v16,50.2 16,55.5 v18.8,58.3 | U1.18 22.1,43.8 22.05,43.85
  Bottom 0.508: v18.8,58.3 16.2,60.5 16.2,63 10.5,63 J9.1 | v20.9,47 20.17,47 19.01,48.16 18.04,48.16 v16,50.2
VIN  (via drill 0.35)
  Top 0.254: U$1.VIN 24.7,8.2 24.4,8.5 | 24.4,8.5 23.5,9.5 11.1,9.5 | JP1.2 23.2,5.6 v25,5.6 | v25,9.1 24.4,8.5
  Top 0.508: 8.7,7.8 R1.2 | 8.7,7.8 J2.VBUS | R1.2 R2.2 | C1.1 8.6,7.9 8.7,7.8 | R1.2 11.04,9.34 | 11.04,9.34 11.1,9.5 | 11.04,9.34 11.04,11.74 11.1,12.2 D8.A
  Bottom 0.254: v25,5.6 v25,9.1
WP
  Top 0.508: JP1-WP.1 J1.WP

### Text on the board
tPlace: ECE411 Group 11 | TakPad Rev 1.6